# EAGLE schematic untitled (EAGLE 9.6.2)
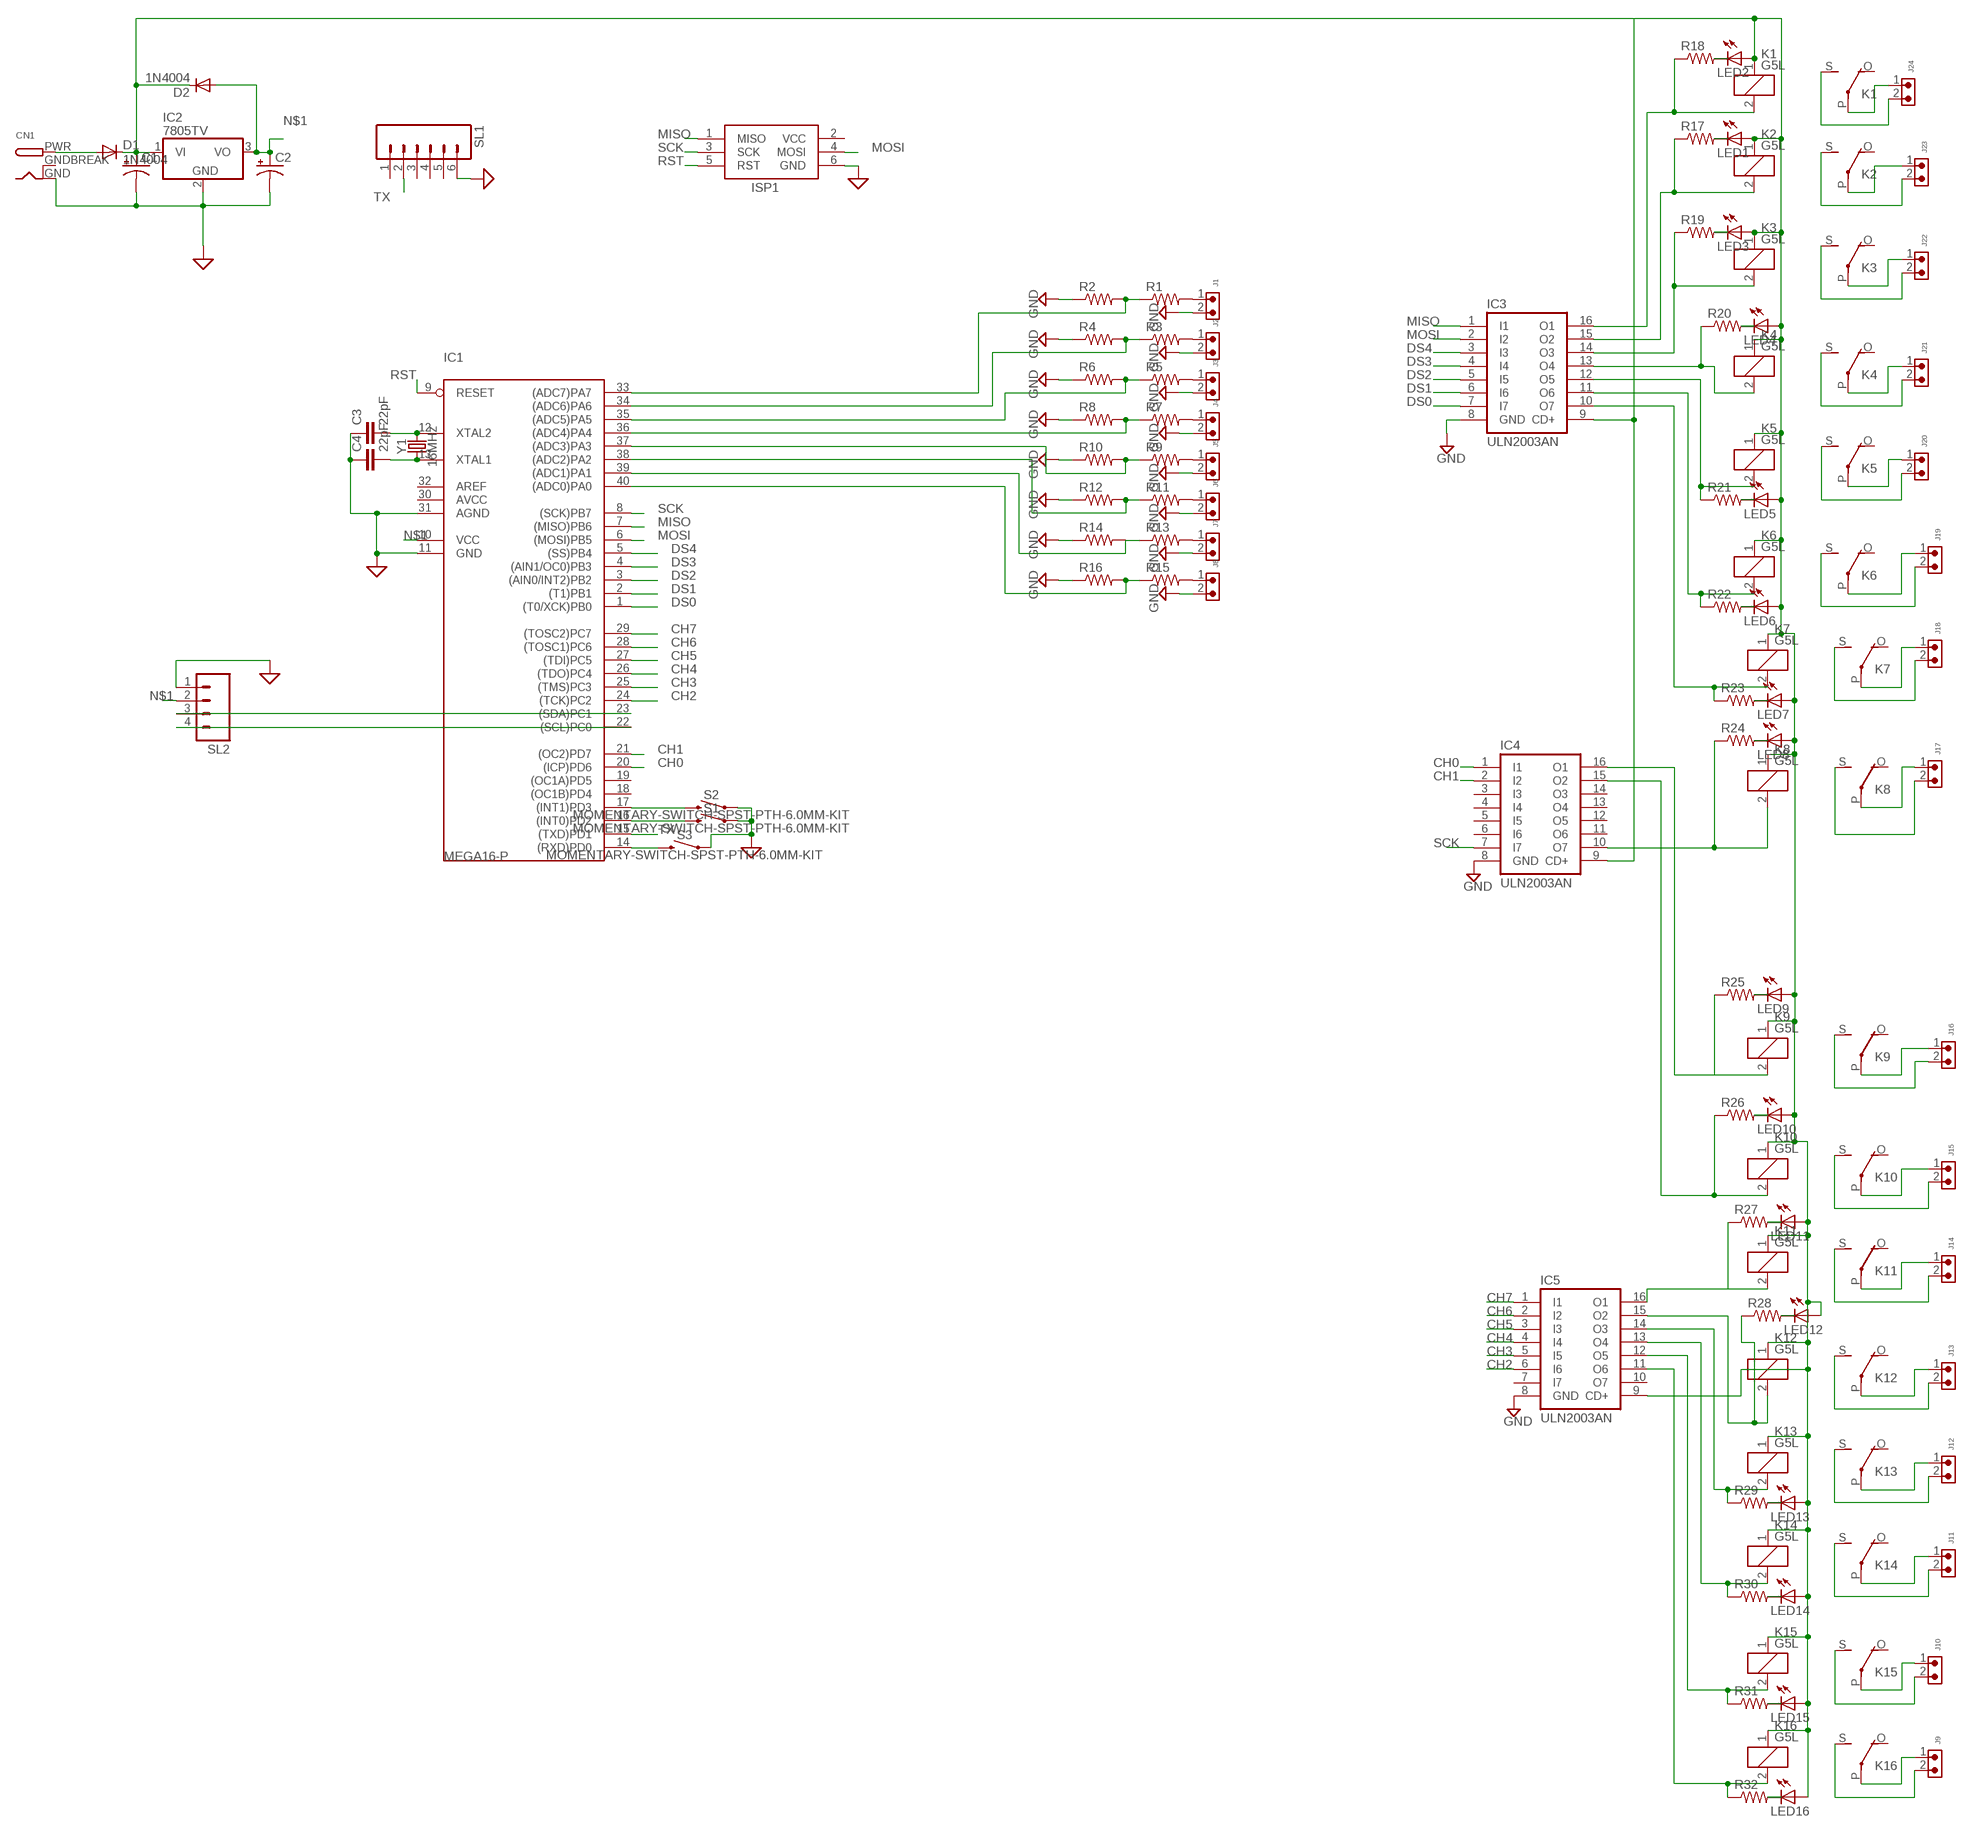
[diagram p0: schematic, sheet 1]

## Parts
C1  CAPACITOR-PE5-10.5  [E5-10,5]
C2  CAPACITOR-PE5-6  [E5-6]
C3  22pF  22PF-PTH-2.54MM-200V-5%  [CAP-PTH-2.54]
C4  22pF  22PF-PTH-2.54MM-200V-5%  [CAP-PTH-2.54]
CN1  DCBARRELPTH  [DCJACK_2MM_PTH]
D1  1N4004  [DO41-10]
D2  1N4004  [DO41-10]
IC1  MEGA16-P  [DIL40]
IC2  7805TV  [TO220V]
IC3  ULN2003AN  [DIL16]
IC4  ULN2003AN  [DIL16]
IC5  ULN2003AN  [DIL16]
ISP1  AVRISP-6  [AVRISP]
J1  691305530002  [691305530002]
J2  691305530002  [691305530002]
J3  691305530002  [691305530002]
J4  691305530002  [691305530002]
J5  691305530002  [691305530002]
J6  691305530002  [691305530002]
J7  691305530002  [691305530002]
J8  691305530002  [691305530002]
J9  691305530002  [691305530002]
J10  691305530002  [691305530002]
J11  691305530002  [691305530002]
J12  691305530002  [691305530002]
J13  691305530002  [691305530002]
J14  691305530002  [691305530002]
J15  691305530002  [691305530002]
J16  691305530002  [691305530002]
J17  691305530002  [691305530002]
J18  691305530002  [691305530002]
J19  691305530002  [691305530002]
J20  691305530002  [691305530002]
J21  691305530002  [691305530002]
J22  691305530002  [691305530002]
J23  691305530002  [691305530002]
J24  691305530002  [691305530002]
K1  G5L  [G5LE]
K2  G5L  [G5LE]
K3  G5L  [G5LE]
K4  G5L  [G5LE]
K5  G5L  [G5LE]
K6  G5L  [G5LE]
K7  G5L  [G5LE]
K8  G5L  [G5LE]
K9  G5L  [G5LE]
K10  G5L  [G5LE]
K11  G5L  [G5LE]
K12  G5L  [G5LE]
K13  G5L  [G5LE]
K14  G5L  [G5LE]
K15  G5L  [G5LE]
K16  G5L  [G5LE]
LED1  LED5MM  [LED5MM]
LED2  LED5MM  [LED5MM]
LED3  LED5MM  [LED5MM]
LED4  LED5MM  [LED5MM]
LED5  LED5MM  [LED5MM]
LED6  LED5MM  [LED5MM]
LED7  LED5MM  [LED5MM]
LED8  LED5MM  [LED5MM]
LED9  LED5MM  [LED5MM]
LED10  LED5MM  [LED5MM]
LED11  LED5MM  [LED5MM]
LED12  LED5MM  [LED5MM]
LED13  LED5MM  [LED5MM]
LED14  LED5MM  [LED5MM]
LED15  LED5MM  [LED5MM]
LED16  LED5MM  [LED5MM]
R1  R-US_0309/12  [0309/12]
R2  R-US_0309/12  [0309/12]
R3  R-US_0309/12  [0309/12]
R4  R-US_0309/12  [0309/12]
R5  R-US_0309/12  [0309/12]
R6  R-US_0309/12  [0309/12]
R7  R-US_0309/12  [0309/12]
R8  R-US_0309/12  [0309/12]
R9  R-US_0309/12  [0309/12]
R10  R-US_0309/12  [0309/12]
R11  R-US_0309/12  [0309/12]
R12  R-US_0309/12  [0309/12]
R13  R-US_0309/12  [0309/12]
R14  R-US_0309/12  [0309/12]
R15  R-US_0309/12  [0309/12]
R16  R-US_0309/12  [0309/12]
R17  R-US_0204/5  [0204/5]
R18  R-US_0204/5  [0204/5]
R19  R-US_0204/5  [0204/5]
R20  R-US_0204/5  [0204/5]
R21  R-US_0204/5  [0204/5]
R22  R-US_0207/10  [0207/10]
R23  R-US_0207/10  [0207/10]
R24  R-US_0204/5  [0204/5]
R25  R-US_0207/10  [0207/10]
R26  R-US_0207/10  [0207/10]
R27  R-US_0207/10  [0207/10]
R28  R-US_0207/10  [0207/10]
R29  R-US_0207/10  [0207/10]
R30  R-US_0207/10  [0207/10]
R31  R-US_0207/10  [0207/10]
R32  R-US_0207/10  [0207/10]
S1  MOMENTARY-SWITCH-SPST-PTH-6.0MM-KIT  [TACTILE_SWITCH_PTH_6.0MM_KIT]
S2  MOMENTARY-SWITCH-SPST-PTH-6.0MM-KIT  [TACTILE_SWITCH_PTH_6.0MM_KIT]
S3  MOMENTARY-SWITCH-SPST-PTH-6.0MM-KIT  [TACTILE_SWITCH_PTH_6.0MM_KIT]
SL1  M06  [06P]
SL2  M04  [04P]
Y1  16MHz  CRYSTAL-16MHZPTH-HC49US  [HC49US]

## Nets
CH0: IC1.20((ICP)PD6) IC4.1(I1)
CH1: IC1.21((OC2)PD7) IC4.2(I2)
CH2: IC1.24((TCK)PC2) IC5.6(I6)
CH3: IC1.25((TMS)PC3) IC5.5(I5)
CH4: IC1.26((TDO)PC4) IC5.4(I4)
CH5: IC1.27((TDI)PC5) IC5.3(I3)
CH6: IC1.28((TOSC1)PC6) IC5.2(I2)
CH7: IC1.29((TOSC2)PC7) IC5.1(I1)
DS0: IC1.1((T0/XCK)PB0) IC3.7(I7)
DS1: IC1.2((T1)PB1) IC3.6(I6)
DS2: IC1.3((AIN0/INT2)PB2) IC3.5(I5)
DS3: IC1.4((AIN1/OC0)PB3) IC3.4(I4)
DS4: IC1.5((SS)PB4) IC3.3(I3)
GND: C1.- C2.- C3.1 C4.1 CN1.GND IC1.11(GND) IC1.31(AGND) IC2.2(GND) IC3.8(GND) IC4.8(GND) IC5.8(GND) ISP1.6(GND) J1.2 J2.2 J3.2 J4.2 J5.2 J6.2 J7.2 J8.2 R2.1 R4.1 R6.1 R8.1 R10.1 R12.1 R14.1 R16.1 S1.1 S2.1 S3.1 SL1.6 SL2.1 ; supply symbol labelled SUP
MISO: IC1.7((MISO)PB6) IC3.1(I1) ISP1.1(MISO)
MOSI: IC1.6((MOSI)PB5) IC3.2(I2) ISP1.4(MOSI)
N$1: C2.+ D2.A IC1.10(VCC) IC2.3(VO) SL2.2
N$2: C1.+ D1.C D2.C IC2.1(VI) IC3.9(CD+) IC4.9(CD+) IC5.9(CD+) K1.1 K2.1 K3.1 K4.1 K5.1 K6.1 K7.1 K8.1 K9.1 K10.1 K11.1 K12.1 K13.1 K14.1 K15.1 K16.1 LED1.A LED2.A LED3.A LED4.A LED5.A LED6.A LED7.A LED8.A LED9.A LED10.A LED11.A LED12.A LED13.A LED14.A LED15.A LED16.A
N$3: IC1.16((INT0)PD2) S1.3
N$4: IC1.23((SDA)PC1) SL2.3
N$5: C3.2 IC1.12(XTAL2) Y1.2
N$6: C4.2 IC1.13(XTAL1) Y1.1
N$7: IC1.22((SCL)PC0) SL2.4
N$8: J1.1 R1.2
N$9: IC1.17((INT1)PD3) S2.3
N$10: IC4.10(O7) K8.2 R24.1
N$11: IC1.33((ADC7)PA7) R1.1 R2.2
N$12: J2.1 R3.2
N$13: IC1.34((ADC6)PA6) R3.1 R4.2
N$14: J3.1 R5.2
N$15: IC1.35((ADC5)PA5) R5.1 R6.2
N$16: J4.1 R7.2
N$17: IC1.36((ADC4)PA4) R7.1 R8.2
N$18: J5.1 R9.2
N$19: J6.1 R11.2
N$20: IC1.38((ADC2)PA2) R11.1 R12.2
N$21: J7.1 R13.2
N$22: IC1.39((ADC1)PA1) R13.1 R14.2
N$23: J8.1 R15.2
N$24: IC1.40((ADC0)PA0) R15.1 R16.2
N$25: IC1.37((ADC3)PA3) R9.1 R10.2
N$26: IC1.14((RXD)PD0) S3.3
N$27: IC4.16(O1) K9.2 R25.1
N$28: IC4.15(O2) K10.2 R26.1
N$29: IC5.16(O1) K11.2 R27.1
N$30: IC5.12(O5) K15.2 R31.1
N$31: IC3.16(O1) K1.2 R18.1
N$32: IC3.15(O2) K2.2 R17.1
N$33: IC3.14(O3) K3.2 R19.1
N$34: IC3.13(O4) K4.2 R20.1
N$35: IC3.12(O5) K5.2 R21.1
N$36: IC3.11(O6) K6.2 R22.1
N$37: IC3.10(O7) K7.2 R23.1
N$38: IC5.13(O4) K14.2 R30.1
N$39: IC5.14(O3) K13.2 R29.1
N$40: IC5.15(O2) K12.2 R28.1
N$41: IC5.11(O6) K16.2 R32.1
N$42: J9.2 K16.S(2:S)
N$43: J9.1 K16.P(2:P)
N$44: J10.1 K15.P(2:P)
N$45: J10.2 K15.S(2:S)
N$46: J11.1 K14.P(2:P)
N$47: J11.2 K14.S(2:S)
N$48: J12.1 K13.P(2:P)
N$49: J12.2 K13.S(2:S)
N$50: J13.1 K12.P(2:P)
N$51: CN1.PWR D1.A
N$52: J13.2 K12.S(2:S)
N$53: J14.1 K11.P(2:P)
N$54: J14.2 K11.S(2:S)
N$55: J15.1 K10.P(2:P)
N$56: J15.2 K10.S(2:S)
N$57: J16.1 K9.P(2:P)
N$58: J16.2 K9.S(2:S)
N$59: J17.1 K8.P(2:P)
N$60: J17.2 K8.S(2:S)
N$61: J18.1 K7.P(2:P)
N$62: J18.2 K7.S(2:S)
N$63: J19.1 K6.P(2:P)
N$64: J19.2 K6.S(2:S)
N$65: J20.1 K5.P(2:P)
N$66: J20.2 K5.S(2:S)
N$67: J21.1 K4.P(2:P)
N$68: J21.2 K4.S(2:S)
N$69: J22.1 K3.P(2:P)
N$70: J22.2 K3.S(2:S)
N$71: J23.1 K2.P(2:P)
N$72: J23.2 K2.S(2:S)
N$73: J24.1 K1.P(2:P)
N$74: J24.2 K1.S(2:S)
N$75: LED2.K(C) R18.2
N$76: LED1.K(C) R17.2
N$77: LED3.K(C) R19.2
N$78: LED4.K(C) R20.2
N$79: LED5.K(C) R21.2
N$80: LED6.K(C) R22.2
N$81: LED7.K(C) R23.2
N$82: LED8.K(C) R24.2
N$83: LED9.K(C) R25.2
N$84: LED10.K(C) R26.2
N$85: LED11.K(C) R27.2
N$86: LED12.K(C) R28.2
N$87: LED13.K(C) R29.2
N$88: LED14.K(C) R30.2
N$89: LED15.K(C) R31.2
N$90: LED16.K(C) R32.2
RST: IC1.9(RESET) ISP1.5(RST)
SCK: IC1.8((SCK)PB7) IC4.7(I7) ISP1.3(SCK)
TX: IC1.15((TXD)PD1) SL1.2
Unconnected: IC1.18((OC1B)PD4) IC1.19((OC1A)PD5) IC4.3(I3) IC4.4(I4) IC4.5(I5) IC4.6(I6) IC4.11(O6) IC4.12(O5) IC4.13(O4) IC4.14(O3) IC5.7(I7) IC5.10(O7) K1.O(2:O) K2.O(2:O) K3.O(2:O) K4.O(2:O) K5.O(2:O) K6.O(2:O) K7.O(2:O) K8.O(2:O) K9.O(2:O) K10.O(2:O) K11.O(2:O) K12.O(2:O) K13.O(2:O) K14.O(2:O) K15.O(2:O) K16.O(2:O) SL1.1 SL1.3 SL1.4 SL1.5

## Power pins joined to a net without a drawn wire
AREF: IC1.32(AREF)
AVCC: IC1.30(AVCC)
GNDBREAK: CN1.GNDBREAK
VCC: ISP1.2(VCC)

## Library data of the parts
C1 C2 = BeagleBone_Blue_R3:CAPACITOR-P: POLARIZED CAPACITOR, American symbol
C3 C4 = SparkFun-Capacitors:22PF: 22pF ceramic capacitors A capacitor is a passive two-terminal electrical component used to store electrical energy temporarily in an electric field.; PROD_ID: CAP-09128
CN1 = adafruit:DCBARREL: 2.0mm DC Barrel Jack DCJACK_2MM_PTH - Through Hole Jack (4UConnector: 05537)
D1 D2 = adafruit:1N4004: DIODE General purpose 1N400x type rectifier (With bigger pads) http://www.ladyada.net/library/pcb/eaglelibrary.html
IC1 = avr-7:MEGA16-P: MICROCONTROLLER 16 Kbytes FLASH 1 kbytes SRAM 512 bytes EEPROM USART 8-channel 10 bit ADC
IC2 = linear:78*: Positive VOLTAGE REGULATOR Source: http://cache.national.com/ds/LM/LM78L05.pdf http://www.fairchildsemi.com/ds/LM/LM7805.pdf
IC3-IC5 = uln-udn:ULN2003A: DRIVER ARRAY
ISP1 = adafruit:AVRISP: AVR ISP HEADER Standard 6 pin header for AVR programming
J1-J24 = Wurth_Connectors_WR-TBL Pluggable Connector:691305530002: WR-TBL Serie 3055 - 5,08 mm - PCB Header Vertical Entry with Plastic Latches KIND PROPERTIES Pitch 5.08 mm MATERIAL PROPERTIES Insulator Material PA66 Insulator Flammability Rating UL94 V-0 Insulator Color Green Terminal Material Copper Alloy Terminal Plating Tin-plated surface GENERAL INFORMATION Operating Temperature -40 up to +105 °C ELECTRICAL PROPERTIES IR UL 16 A Working Voltage [UL] 300 V (AC) Withstanding Voltage [UL] 2500 V (AC) Contact Resistance [UL] 20 mΩ CERTIFICATION UL Approval E315414 <https://www.we-online.com/catalog/media/o135349v209%20Family_WR-TBL3_6913055300xx.jpg> Details see: https://www.we-online.com/catalog/en/TBL_5_08_3055_6913055300XX/ Updated by Ella Wu 2019-12-30 2019(C) Wurth Elektronik; DATASHEET-URL: https://www.we-online.com/catalog/datasheet/691305530002.pdf; IR-UL: 16A; MOUNT: THT; PART-NUMBER: 691305530002; PINS: 2; PITCH: 5.08mm; TYPE: Vertical; WORKING-VOLTAGE-UL: 300V (AC)
K1-K16 = relay:G5L: RELAY 1 x switch, 10 A/120 V AC, 8 A/30 V ADC, Omron; OC_FARNELL: unknown; OC_NEWARK: unknown
LED1-LED16 = adafruit:LED: LED OSRAM: - CHIPLED LG R971, LG N971, LY N971, LG Q971, LY Q971, LO R971, LY R971 LH N974, LH R974 LS Q976, LO Q976, LY Q976 LO Q996 - Hyper CHIPLED LW Q18S LB Q993, LB Q99A, LB R99A - SideLED LS A670, LO A670, LY A670, LG A670, LP A670 LB A673, LV A673, LT A673, LW A673 LH A674 LY A675 LS A676, LA A676, LO A676, LY A676, LW A676 LS A679, LY A679, LG A679 - Hyper Micro SIDELED® LS Y876, LA Y876, LO Y876, LY Y876 LT Y87S - SmartLED LW L88C, LW L88S LB L89C, LB L89S, LG L890 LS L89K, LO L89K, LY L89K LS L896, LA L896, LO L896, LY L896 - TOPLED LS T670, LO T670, LY T670, LG T670, LP T670 LSG T670, LSP T670, LSY T670, LOP T670, LYG T670 LG T671, LOG T671, LSG T671 LB T673, LV T673, LT T673, LW T673 LH T674 LS T676, LA T676, LO T676, LY T676, LB T676, LH T676, LSB T676, LW T676 LB T67C, LV T67C, LT T67C, LS T67K, LO T67K, LY T67K, LW E67C LS E67B, LA E67B, LO E67B, LY E67B, LB E67C, LV E67C, LT E67C LW T67C LS T679, LY T679, LG T679 LS T770, LO T770, LY T770, LG T770, LP T770 LB T773, LV T773, LT T773, LW T773 LH T774 LS E675, LA E675, LY E675, LS T675 LS T776, LA T776, LO T776, LY T776, LB T776 LHGB T686 LT T68C, LB T68C - Hyper Mini TOPLED® LB M676 - Mini TOPLED Santana® LG M470 LS M47K, LO M47K, LY M47K Source: http://www.osram.convergy.de/
R1-R16 = BeagleBone_Black_Wireless:R-US_: RESISTOR, American symbol
R17-R32 = adafruit:R-US_: RESISTOR, American symbol
S1-S3 = SparkFun-Switches:MOMENTARY-SWITCH-SPST: Momentary Switch (Pushbutton) - SPST Normally-open (NO) SPST momentary switches (buttons, pushbuttons). Variants PTH-12MM - 12mm square, through-hole Momentary Pushbutton Switch - 12mm Square <https://www.sparkfun.com/products/9190> (COM-09190) PTH-6.0MM, PTH-6.0MM-KIT - 6.0mm square, through-hole Mini Pushbutton Switch <https://www.sparkfun.com/products/97> (COM-00097) KIT package intended for soldering kit's - only one side of pads' copper is exposed. PTH-RIGHT-ANGLE-KIT - Right-angle, through-hole Right Angle Tactile Button <https://www.sparkfun.com/products/10791> - Used on SparkFun BigTime Watch Kit <https://www.sparkfun.com/products/11734> SMD-12MM - 12mm square, surface-mount Tactile Button - SMD (12mm) <https://www.sparkfun.com/products/12993> (COM-12993) Used on SparkFun PicoBoard <https://www.sparkfun.com/products/11888> SMD-4.5MM - 4.5mm Square Trackball Switch Used on SparkFun Blackberry Trackballer Breakout <https://www.sparkfun.com/products/13169> SMD-4.6MMX2.8MM - 4.60mm x 2.80mm, surface mount Used on SparkFun SAMD21 Mini Breakout <https://www.sparkfun.com/products/13664> SMD-5.2MM, SMD-5.2-REDUNDANT - 5.2mm square, surface-mount Mini Pushbutton Switch - SMD <https://www.sparkfun.com/products/8720> (COM-08720) Used on Arduino Pro Mini <https://www.sparkfun.com/products/11114> REDUNDANT package connects both switch circuits together SMD-6.0X3.5MM - 6.0 x 3.5mm, surface mount Momentary Reset Switch SMD <https://www.sparkfun.com/products/8229> (COM-08229) SMD-6.2MM-TALL - 6.2mm square, surface mount Tactile Button - SMD (6mm) <https://www.sparkfun.com/products/12992> Used on SparkFun Digital Sandbox <https://www.sparkfun.com/products/12651> SMD-RIGHT-ANGLE - Right-angle, surface mount Used on SparkFun Block for Intel® Edison - Arduino <https://www.sparkfun.com/products/13036>; PROD_ID: SWCH-08441; SF_SKU: COM-00097
SL1 = con-amp-quick:M06: AMP QUICK CONNECTOR; OC_FARNELL: unknown; OC_NEWARK: unknown
SL2 = con-amp-quick:M04: AMP QUICK CONNECTOR; OC_FARNELL: unknown; OC_NEWARK: unknown
Y1 = SparkFun-Clocks:CRYSTAL-16MHZ: 16MHz Crystal Digikey Example <http://www.digikey.com/product-search/en?keywords=535-9122-1-ND> Frequency: 16MHz Frequency Stability: ±50ppm Frequency Tolerance: ±20ppm Load Capacitance: 18pF SparkFun Products: Pro Micro -5V/16MHz <https://www.sparkfun.com/products/12640> SparkFun Serial Enabled LCD Kit <https://www.sparkfun.com/products/10097>; PROD_ID: XTAL-08181; SF_ID: COM-00536